# EAGLE schematic hand_pcb (EAGLE 7.5.0)
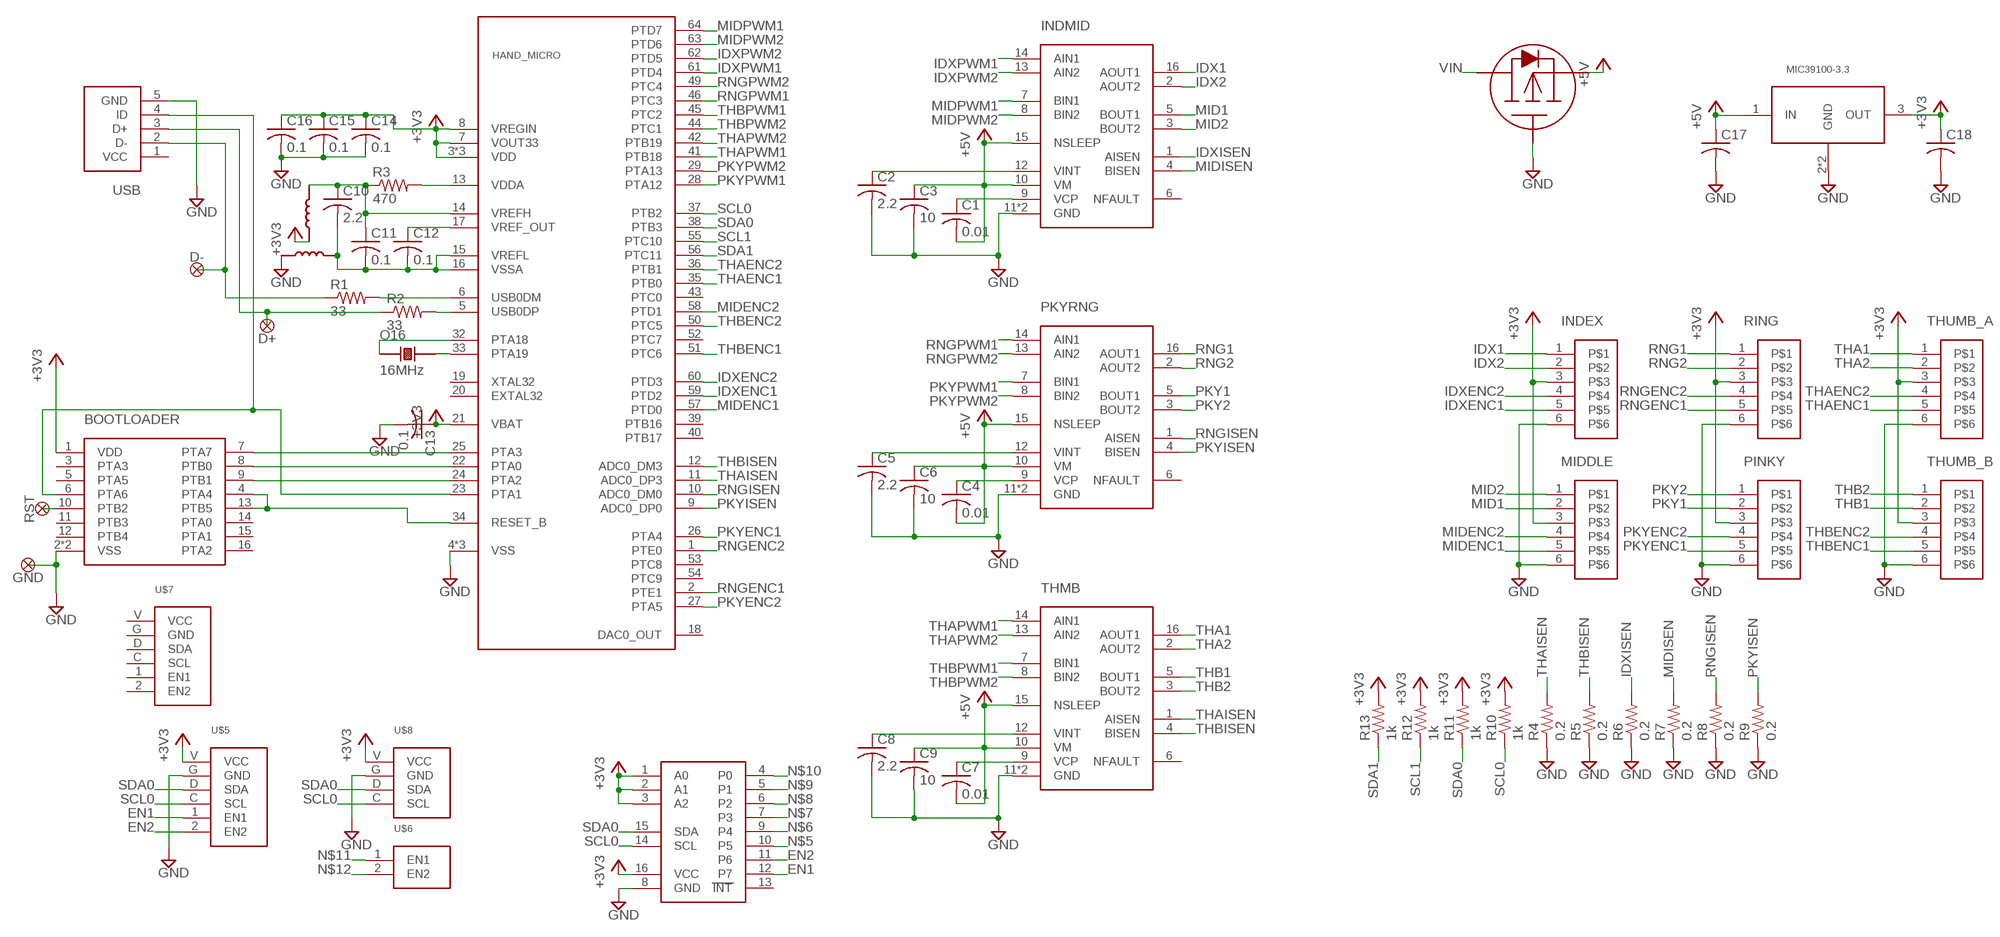
[diagram p0: schematic, sheet 1]

## Parts
BOOTLOADER  MKL02Z32  [WQFN-16]
C1  0.01  C-USC0603  [C0603]
C2  2.2  C-USC0603  [C0603]
C3  10  C-USC0603  [C0603]
C4  0.01  C-USC0603  [C0603]
C5  2.2  C-USC0603  [C0603]
C6  10  C-USC0603  [C0603]
C7  0.01  C-USC0603  [C0603]
C8  2.2  C-USC0603  [C0603]
C9  10  C-USC0603  [C0603]
C10  2.2  C-USC0402  [C0402]
C11  0.1  C-USC0402  [C0402]
C12  0.1  C-USC0402  [C0402]
C13  0.1  C-USC0402  [C0402]
C14  0.1  C-USC0402  [C0402]
C15  0.1  C-USC0402  [C0402]
C16  0.1  C-USC0402  [C0402]
C17  C-USC0603  [C0603]
C18  C-USC0603  [C0603]
D+  TESTPAD  [TESTPAD]
D-  TESTPAD  [TESTPAD]
GND  TESTPAD  [TESTPAD]
HAND_MICRO  MK20DX256VLH7  [LQFP-64-10-10]
INDEX  DF57H-6PTOP  [DF57H-6P-TOP]
INDMID  DRV8833  [WQFN-16]
MIDDLE  DF57H-6PTOP  [DF57H-6P-TOP]
O16  16MHz  NX3225SA  [NX3225SA]
PINKY  DF57H-6PTOP  [DF57H-6P-TOP]
PKYRNG  DRV8833  [WQFN-16]
R1  33  R-US_R0402  [R0402]
R2  33  R-US_R0402  [R0402]
R3  470  R-US_R0402  [R0402]
R4  0.2  R-US_R1206  [R1206]
R5  0.2  R-US_R1206  [R1206]
R6  0.2  R-US_R1206  [R1206]
R7  0.2  R-US_R1206  [R1206]
R8  0.2  R-US_R1206  [R1206]
R9  0.2  R-US_R1206  [R1206]
R10  1k  R-US_R0603  [R0603]
R11  1k  R-US_R0603  [R0603]
R12  1k  R-US_R0603  [R0603]
R13  1k  R-US_R0603  [R0603]
RING  DF57H-6PTOP  [DF57H-6P-TOP]
RST  TESTPAD  [TESTPAD]
THMB  DRV8833  [WQFN-16]
THUMB_A  DF57H-6PTOP  [DF57H-6P-TOP]
THUMB_B  DF57H-6PTOP  [DF57H-6P-TOP]
U$1  TCA9534TSSOP  [TSSOP16]
U$2  SPD15P10PLG  [PG-TO-252-3]
U$3  FERRITE600OHM100MHZ  [L0603]
U$4  FERRITE600OHM100MHZ  [L0603]
U$5  PSENSE  [PSENSE]
U$6  PSENSE2  [PSENSE2]
U$7  PSENSE  [PSENSE]
U$8  PSENSE4  [PSENSE4]
U$9  MIC391003.3  [MIC39100]
USB  10118194-0001LF  [10118194-0001LF]

## Nets
+3V3: BOOTLOADER.1(VDD) C13.1 C14.1 C15.1 C16.1 C18.1 HAND_MICRO.3(VDD) HAND_MICRO.7(VOUT33) HAND_MICRO.8(VREGIN) HAND_MICRO.21(VBAT) HAND_MICRO.30(VDD) HAND_MICRO.48(VDD) INDEX.3 MIDDLE.3 PINKY.3 R10.2 R11.2 R12.2 R13.2 RING.3 THUMB_A.3 THUMB_B.3 U$1.1(A0) U$1.2(A1) U$1.3(A2) U$1.16(VCC) U$4.1 U$5.V(VCC) U$8.V(VCC) U$9.3(OUT)
+5V: C1.2 C3.1 C4.2 C6.1 C7.2 C9.1 C17.1 INDMID.10(VM) INDMID.15(NSLEEP) PKYRNG.10(VM) PKYRNG.15(NSLEEP) THMB.10(VM) THMB.15(NSLEEP) U$2.3 U$9.1(IN)
EN1: U$1.12(P7) U$5.1(EN1)
EN2: U$1.11(P6) U$5.2(EN2)
GND: BOOTLOADER.2(VSS) BOOTLOADER.PPAD(VSS) C2.2 C3.2 C5.2 C6.2 C8.2 C9.2 C13.2 C14.2 C15.2 C16.2 C17.2 C18.2 GND.P$1 HAND_MICRO.4(VSS) HAND_MICRO.31(VSS) HAND_MICRO.47(VSS) INDEX.6 INDMID.11(GND) INDMID.PPAD(GND) MIDDLE.6 PINKY.6 PKYRNG.11(GND) PKYRNG.PPAD(GND) R4.1 R5.1 R6.1 R7.1 R8.1 R9.1 RING.6 THMB.11(GND) THMB.PPAD(GND) THUMB_A.6 THUMB_B.6 U$1.8(GND) U$2.1 U$3.1 U$5.G(GND) U$8.G(GND) U$9.2(GND) U$9.TAB(GND) USB.5(GND)
IDX1: INDEX.1 INDMID.16(AOUT1)
IDX2: INDEX.2 INDMID.2(AOUT2)
IDXENC1: HAND_MICRO.59(PTD2) INDEX.5
IDXENC2: HAND_MICRO.60(PTD3) INDEX.4
IDXISEN: INDMID.1(AISEN) R6.2
IDXPWM1: HAND_MICRO.61(PTD4) INDMID.14(AIN1)
IDXPWM2: HAND_MICRO.62(PTD5) INDMID.13(AIN2)
MID1: INDMID.5(BOUT1) MIDDLE.2
MID2: INDMID.3(BOUT2) MIDDLE.1
MIDENC1: HAND_MICRO.57(PTD0) MIDDLE.5
MIDENC2: HAND_MICRO.58(PTD1) MIDDLE.4
MIDISEN: INDMID.4(BISEN) R7.2
MIDPWM1: HAND_MICRO.64(PTD7) INDMID.7(BIN1)
MIDPWM2: HAND_MICRO.63(PTD6) INDMID.8(BIN2)
N$5: U$1.10(P5)
N$6: U$1.9(P4)
N$7: U$1.7(P3)
N$8: U$1.6(P2)
N$9: U$1.5(P1)
N$10: U$1.4(P0)
N$11: U$6.1(EN1)
N$12: U$6.2(EN2)
N$13: BOOTLOADER.7(PTA7) HAND_MICRO.25(PTA3)
N$14: BOOTLOADER.8(PTB0) HAND_MICRO.22(PTA0)
N$15: BOOTLOADER.9(PTB1) HAND_MICRO.24(PTA2)
N$17: BOOTLOADER.4(PTA4) BOOTLOADER.13(PTB5) HAND_MICRO.34(RESET_B)
N$18: C10.2 C11.2 C12.2 HAND_MICRO.15(VREFL) HAND_MICRO.16(VSSA) U$3.2
N$21: C1.1 INDMID.9(VCP)
N$22: C4.1 PKYRNG.9(VCP)
N$23: C7.1 THMB.9(VCP)
N$24: HAND_MICRO.33(PTA19) O16.3
N$25: C8.1 THMB.12(VINT)
N$26: C5.1 PKYRNG.12(VINT)
N$27: C2.1 INDMID.12(VINT)
N$28: HAND_MICRO.32(PTA18) O16.1
N$31: BOOTLOADER.10(PTB2) RST.P$1
N$32: HAND_MICRO.13(VDDA) R3.2
N$33: C10.1 C11.1 HAND_MICRO.14(VREFH) R3.1 U$4.2
N$34: C12.1 HAND_MICRO.17(VREF_OUT)
N$35: BOOTLOADER.6(PTA6) HAND_MICRO.23(PTA1) USB.4(ID)
PKY1: PINKY.2 PKYRNG.5(BOUT1)
PKY2: PINKY.1 PKYRNG.3(BOUT2)
PKYENC1: HAND_MICRO.26(PTA4) PINKY.5
PKYENC2: HAND_MICRO.27(PTA5) PINKY.4
PKYISEN: HAND_MICRO.9(ADC0_DP0) PKYRNG.4(BISEN) R9.2
PKYPWM1: HAND_MICRO.28(PTA12) PKYRNG.7(BIN1)
PKYPWM2: HAND_MICRO.29(PTA13) PKYRNG.8(BIN2)
RNG1: PKYRNG.16(AOUT1) RING.1
RNG2: PKYRNG.2(AOUT2) RING.2
RNGENC1: HAND_MICRO.2(PTE1) RING.5
RNGENC2: HAND_MICRO.1(PTE0) RING.4
RNGISEN: HAND_MICRO.10(ADC0_DM0) PKYRNG.1(AISEN) R8.2
RNGPWM1: HAND_MICRO.46(PTC3) PKYRNG.14(AIN1)
RNGPWM2: HAND_MICRO.49(PTC4) PKYRNG.13(AIN2)
SCL0: HAND_MICRO.37(PTB2) R10.1 U$1.14(SCL) U$5.C(SCL) U$8.C(SCL)
SCL1: HAND_MICRO.55(PTC10) R12.1
SDA0: HAND_MICRO.38(PTB3) R11.1 U$1.15(SDA) U$5.D(SDA) U$8.D(SDA)
SDA1: HAND_MICRO.56(PTC11) R13.1
THA1: THMB.16(AOUT1) THUMB_A.1
THA2: THMB.2(AOUT2) THUMB_A.2
THAENC1: HAND_MICRO.35(PTB0) THUMB_A.5
THAENC2: HAND_MICRO.36(PTB1) THUMB_A.4
THAISEN: HAND_MICRO.11(ADC0_DP3) R4.2 THMB.1(AISEN)
THAPWM1: HAND_MICRO.41(PTB18) THMB.14(AIN1)
THAPWM2: HAND_MICRO.42(PTB19) THMB.13(AIN2)
THB1: THMB.5(BOUT1) THUMB_B.2
THB2: THMB.3(BOUT2) THUMB_B.1
THBENC1: HAND_MICRO.51(PTC6) THUMB_B.5
THBENC2: HAND_MICRO.50(PTC5) THUMB_B.4
THBISEN: HAND_MICRO.12(ADC0_DM3) R5.2 THMB.4(BISEN)
THBPWM1: HAND_MICRO.45(PTC2) THMB.7(BIN1)
THBPWM2: HAND_MICRO.44(PTC1) THMB.8(BIN2)
USB_D1_N [USB]: D-.P$1 R1.1 USB.2(D-)
USB_D1_P [USB]: D+.P$1 R2.1 USB.3(D+)
USB_D2_N [USB]: HAND_MICRO.6(USB0DM) R1.2
USB_D2_P [USB]: HAND_MICRO.5(USB0DP) R2.2
VIN: U$2.2
Unconnected: BOOTLOADER.3(PTA3) BOOTLOADER.5(PTA5) BOOTLOADER.11(PTB3) BOOTLOADER.12(PTB4) BOOTLOADER.14(PTA0) BOOTLOADER.15(PTA1) BOOTLOADER.16(PTA2) HAND_MICRO.18(DAC0_OUT) HAND_MICRO.19(XTAL32) HAND_MICRO.20(EXTAL32) HAND_MICRO.39(PTB16) HAND_MICRO.40(PTB17) HAND_MICRO.43(PTC0) HAND_MICRO.52(PTC7) HAND_MICRO.53(PTC8) HAND_MICRO.54(PTC9) INDMID.6(NFAULT) PKYRNG.6(NFAULT) THMB.6(NFAULT) U$1.13(INT) U$7.1(EN1) U$7.2(EN2) U$7.C(SCL) U$7.D(SDA) U$7.G(GND) U$7.V(VCC) USB.1(VCC)

## Library data of the parts
BOOTLOADER = 445-eagle-lib:MKL02Z32
C1-C18 = rcl:C-US: CAPACITOR, American symbol
D+ D- GND RST = 445-eagle-lib:TESTPAD
HAND_MICRO = 445-eagle-lib:MK20DX256VLH7
INDEX MIDDLE PINKY RING THUMB_A THUMB_B = 445-eagle-lib:DF57H-6P
INDMID PKYRNG THMB = 445-eagle-lib:DRV8833
O16 = 445-eagle-lib:NX3225SA
R1-R13 = rcl:R-US_: RESISTOR, American symbol
U$1 = 445-eagle-lib:TCA9534: 8 Bit IO Expander
U$2 = 445-eagle-lib:SPD15P10PLG
U$3 U$4 = 445-eagle-lib:FERRITE600OHM100MHZ
U$5 U$7 = 445-eagle-lib:PSENSE
U$6 = 445-eagle-lib:PSENSE2
U$8 = 445-eagle-lib:PSENSE4
U$9 = 445-eagle-lib:MIC391003.3
USB = 445-eagle-lib:10118194-0001LF

## Net classes
1 USB: width 0.333 mm, drill 0.333 mm, clearance 0.178 mm
2 VCC_Pour: clearance 0.762 mm to class 1
3 GND_Pour: clearance 0.762 mm to class 1